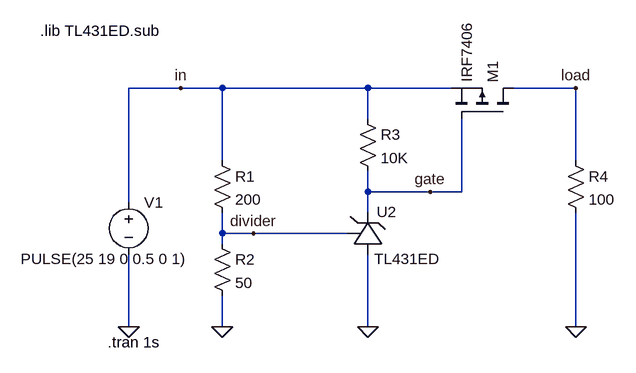
[diagram p0: schematic low_voltage_simple.asc]
low_voltage_simple.asc, the LTspice schematic file:
Version 4
SHEET 1 880 680
WIRE 32 -48 -48 -48
WIRE 96 -48 32 -48
WIRE 320 -48 96 -48
WIRE 448 -48 320 -48
WIRE 640 -48 544 -48
WIRE 320 0 320 -48
WIRE 96 64 96 -48
WIRE 640 64 640 -48
WIRE 320 112 320 80
WIRE 416 112 320 112
WIRE 464 112 464 0
WIRE 464 112 416 112
WIRE -48 128 -48 -48
WIRE 320 144 320 112
WIRE 96 176 96 144
WIRE 144 176 96 176
WIRE 288 176 144 176
WIRE 96 192 96 176
WIRE -48 320 -48 208
WIRE 96 320 96 272
WIRE 320 320 320 208
WIRE 640 320 640 144
FLAG 96 320 0
FLAG 320 320 0
FLAG 640 320 0
FLAG -48 320 0
FLAG 640 -48 load
FLAG 416 112 gate
FLAG 144 176 divider
FLAG 32 -48 in
SYMBOL voltage -48 112 R0
WINDOW 123 0 0 Left 0
WINDOW 39 0 0 Left 0
WINDOW 3 -166 103 Left 2
SYMATTR InstName V1
SYMATTR Value PULSE(25 19 0 0.5 0 1)
SYMBOL res 80 48 R0
SYMATTR InstName R1
SYMATTR Value 200
SYMBOL res 80 176 R0
SYMATTR InstName R2
SYMATTR Value 50
SYMBOL res 304 -16 R0
SYMATTR InstName R3
SYMATTR Value 10K
SYMBOL pmos 544 0 M270
SYMATTR InstName M1
SYMATTR Value IRF7406
SYMBOL res 624 48 R0
SYMATTR InstName R4
SYMATTR Value 100
SYMBOL TL431 320 176 M0
WINDOW 0 -44 -33 Left 2
WINDOW 3 -61 39 Center 2
SYMATTR InstName U2
TEXT -80 344 Left 2 !.tran 1s
TEXT -184 -136 Left 2 !.lib TL431ED.sub

The netlist it stands for:
* low_voltage_simple.asc
V1 in 0 PULSE(25 19 0 0.5 0 1)
R1 in divider 200
R2 divider 0 50
R3 in gate 10K
M1 load gate in in IRF7406
R4 load 0 100
XU2 gate 0 divider TL431ED  ; pins CATHODE ANODE REF
.model NMOS NMOS
.model PMOS PMOS
.lib standard.mos
.tran 1s
.lib TL431ED.sub
.backanno
.end